# EAGLE design Frame2TTL_v2_1_1 (EAGLE 9.6.2)
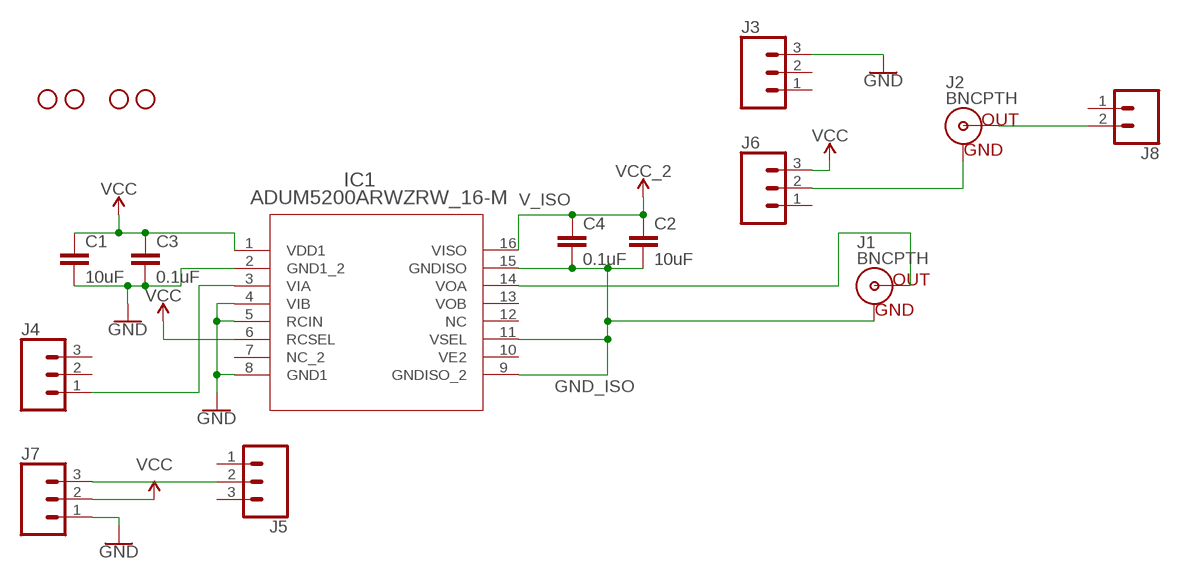
[diagram p0: schematic, sheet 1]

## Parts
C1  10uF  10UF-1206-6.3V-20%  [1206]
C2  10uF  10UF-1206-6.3V-20%  [1206]
C3  0.1uF  10UF-0805-10V-10%  [0805]
C4  0.1uF  10UF-0805-10V-10%  [0805]
H1  STAND-OFF  [STAND-OFF]
H2  STAND-OFF  [STAND-OFF]
H3  STAND-OFF  [STAND-OFF]
H4  STAND-OFF  [STAND-OFF]
IC1  ADUM5200ARWZRW_16-M  [RW_16-M]
J1  BNCPTH  [BNC]
J2  BNCPTH  [BNC]
J3  CONN_03LOCK  [1X03_LOCK]
J4  CONN_03LOCK  [1X03_LOCK]
J5  CONN_03LOCK  [1X03_LOCK]
J6  CONN_03LOCK  [1X03_LOCK]
J7  CONN_03LOCK  [1X03_LOCK]
J8  CONN_02  [1X02]

## Nets
AGND: J2.GND J6.2
GND: C1.2 C3.2 IC1.2(GND1_2) IC1.4(VIB) IC1.5(RCIN) IC1.8(GND1) J3.3 J7.1
GND_ISO: C2.2 C4.2 IC1.9(GNDISO_2) IC1.11(VSEL) IC1.15(GNDISO) J1.GND
N$1: J2.S(OUT) J8.2
N$2: IC1.3(VIA) J4.1
N$3: J5.2 J7.3
N$6: IC1.14(VOA) J1.S(OUT)
V_ISO: C2.1 C4.1 IC1.16(VISO) ; supply symbol labelled VCC_2
VCC: C1.1 C3.1 IC1.1(VDD1) IC1.6(RCSEL) J6.3 J7.2
Unconnected: IC1.7(NC_2) IC1.10(VE2) IC1.12(NC) IC1.13(VOB) J3.1 J3.2 J4.2 J4.3 J5.1 J5.3 J6.1 J8.1

## Library data of the parts
C1 C2 = SparkFun-Capacitors:10UF: 10.0µF ceramic capacitors A capacitor is a passive two-terminal electrical component used to store electrical energy temporarily in an electric field.; PROD_ID: CAP-10057
C3 C4 = SparkFun-Capacitors:10UF: 10.0µF ceramic capacitors A capacitor is a passive two-terminal electrical component used to store electrical energy temporarily in an electric field.; PROD_ID: CAP-11330; VALUE: 10uF
H1-H4 = SparkFun-Hardware:STAND-OFF: Stand Off Drill holes for mechanically mounting via screws, standoffs, etc. Note: Use the keepout ring to avoid running the screw head into surrounding components. Variant Overviews STAND-OFF - Mechanical footprint for a #4 phillips button head screw. STAND-OFF-TIGHT - Mechanical footprint for a #4 phillips button head screw, Example SparkFun Products Screw - Phillips Head (1/4", 4-40, 10 pack) <https://www.sparkfun.com/products/10453> (PRT-10453) Screw - Phillips Head (1/2", 4-40, 10 pack) <https://www.sparkfun.com/products/10452> (PRT-10452) Screw - Phillips Head (3/4", 4-40, 10 pack) <https://www.sparkfun.com/products/10451> (PRT-10451) Screw - Phillips Head (1", 4-40, 10 pack) <https://www.sparkfun.com/products/10450> (PRT-10450)
IC1 = ADUM5200:ADUM5200ARWZ
J1 J2 = SparkFun-Connectors:BNC: BNC Right Angle Connector Mouser Part# 5227161 SparkFun Products: BNC Connector - Right Angle <https://www.sparkfun.com/products/10550>; PROD_ID: LPA-12729; SF_ID: PRT-10550
J3-J7 = SparkFun-Connectors:CONN_03: Multi connection point. Often used as Generic Header-pin footprint for 0.1 inch spaced/style header connections On any of the 0.1 inch spaced packages, you can populate with these: Break Away Headers - Straight <https://www.sparkfun.com/products/116> (PRT-00116) Break Away Male Headers - Right Angle <https://www.sparkfun.com/products/553> (PRT-00553) Female Headers <https://www.sparkfun.com/products/115> (PRT-00115) Break Away Headers - Machine Pin <https://www.sparkfun.com/products/117> (PRT-00117) Break Away Female Headers - Swiss Machine Pin <https://www.sparkfun.com/products/743> (PRT-00743) Stackable Header - 3 Pin (Female, 0.1") <https://www.sparkfun.com/products/13875> (PRT-13875) For SCREWTERMINALS and SPRING TERMINALS visit here: Screw Terimnals on SparkFun.com <https://www.sparkfun.com/search/results?term=Screw+Terminals> (5mm/3.5mm/2.54mm spacing) This device is also useful as a general connection point to wire up your design to another part of your project. Our various solder wires solder well into these plated through hole pads. Hook-Up Wire - Assortment (Stranded, 22 AWG) <https://www.sparkfun.com/products/11375> (PRT-11375) Hook-Up Wire - Assortment (Solid Core, 22 AWG) <https://www.sparkfun.com/products/11367> (PRT-11367) View the entire wire category on our website here <https://www.sparkfun.com/categories/141> Special notes: Molex polarized connector foot print use with SKU : PRT-08232 with associated crimp pins and housings.
J8 = SparkFun-Connectors:CONN_02: Multi connection point. Often used as Generic Header-pin footprint for 0.1 inch spaced/style header connections On any of the 0.1 inch spaced packages, you can populate with these: Break Away Headers - Straight <https://www.sparkfun.com/products/116> (PRT-00116) Break Away Male Headers - Right Angle <https://www.sparkfun.com/products/553> (PRT-00553) Female Headers <https://www.sparkfun.com/products/115> (PRT-00115) Break Away Headers - Machine Pin <https://www.sparkfun.com/products/117> (PRT-00117) Break Away Female Headers - Swiss Machine Pin <https://www.sparkfun.com/products/743> (PRT-00743) For SCREWTERMINALS and SPRING TERMINALS visit here: Screw Terimnals on SparkFun.com <https://www.sparkfun.com/search/results?term=Screw+Terminals> (5mm/3.5mm/2.54mm spacing) This device is also useful as a general connection point to wire up your design to another part of your project. Our various solder wires solder well into these plated through hole pads. Hook-Up Wire - Assortment (Stranded, 22 AWG) <https://www.sparkfun.com/products/11375> (PRT-11375) Hook-Up Wire - Assortment (Solid Core, 22 AWG) <https://www.sparkfun.com/products/11367> (PRT-11367) View the entire wire category on our website here <https://www.sparkfun.com/categories/141> Special notes: Molex polarized connector foot print use with: PRT-08233 with associated crimp pins and housings. 2.54_SCREWTERM for use with PRT-10571. 3.5mm Screw Terminal footprints for PRT-08084 5mm Screw Terminal footprints for use with PRT-08432

## Board
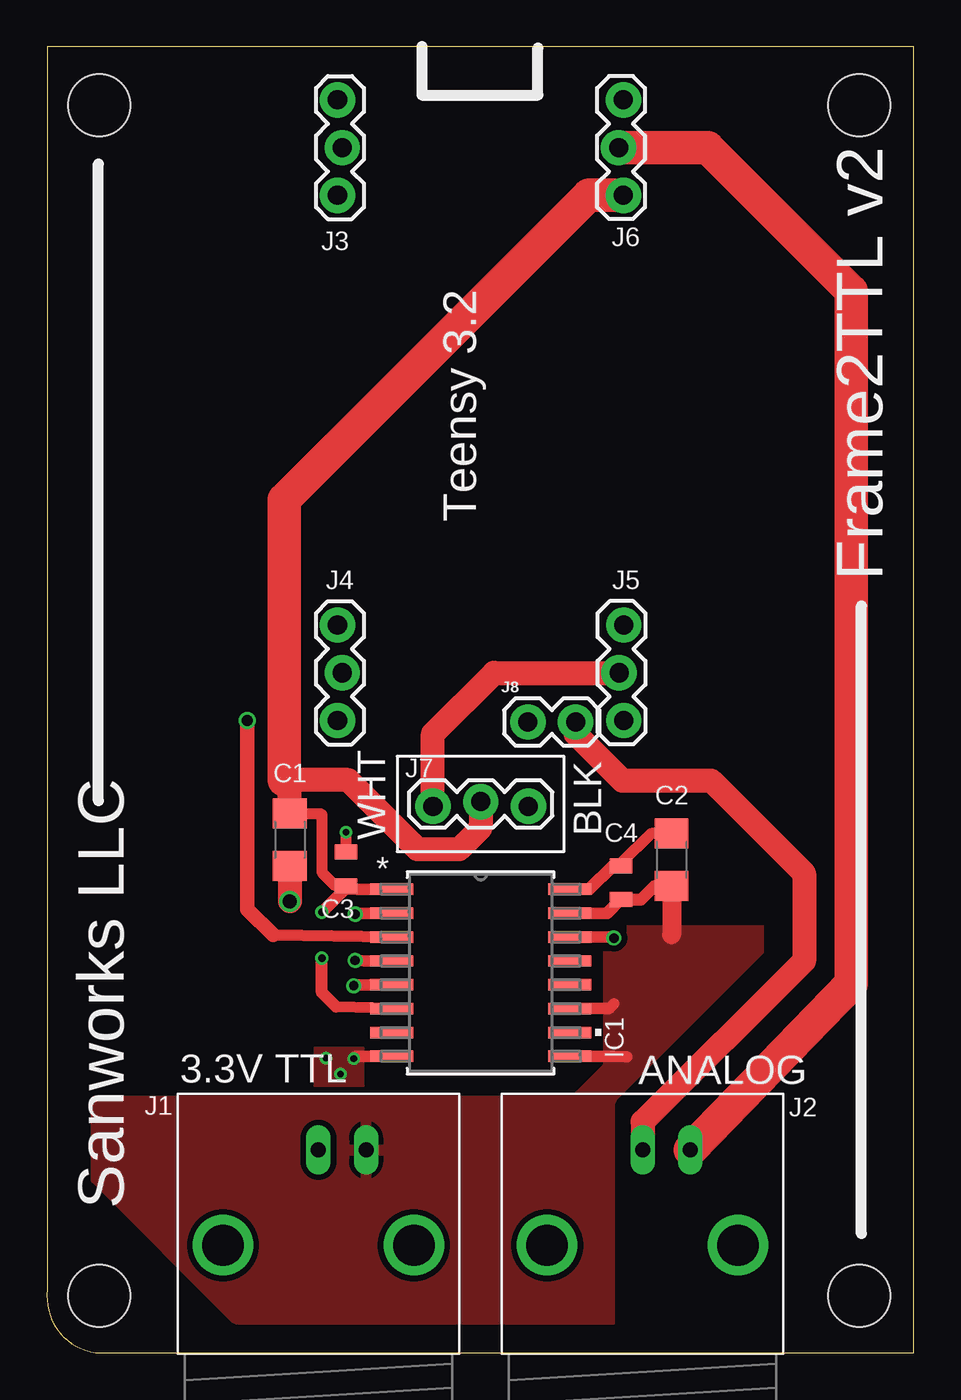
[diagram p1: board, top side]
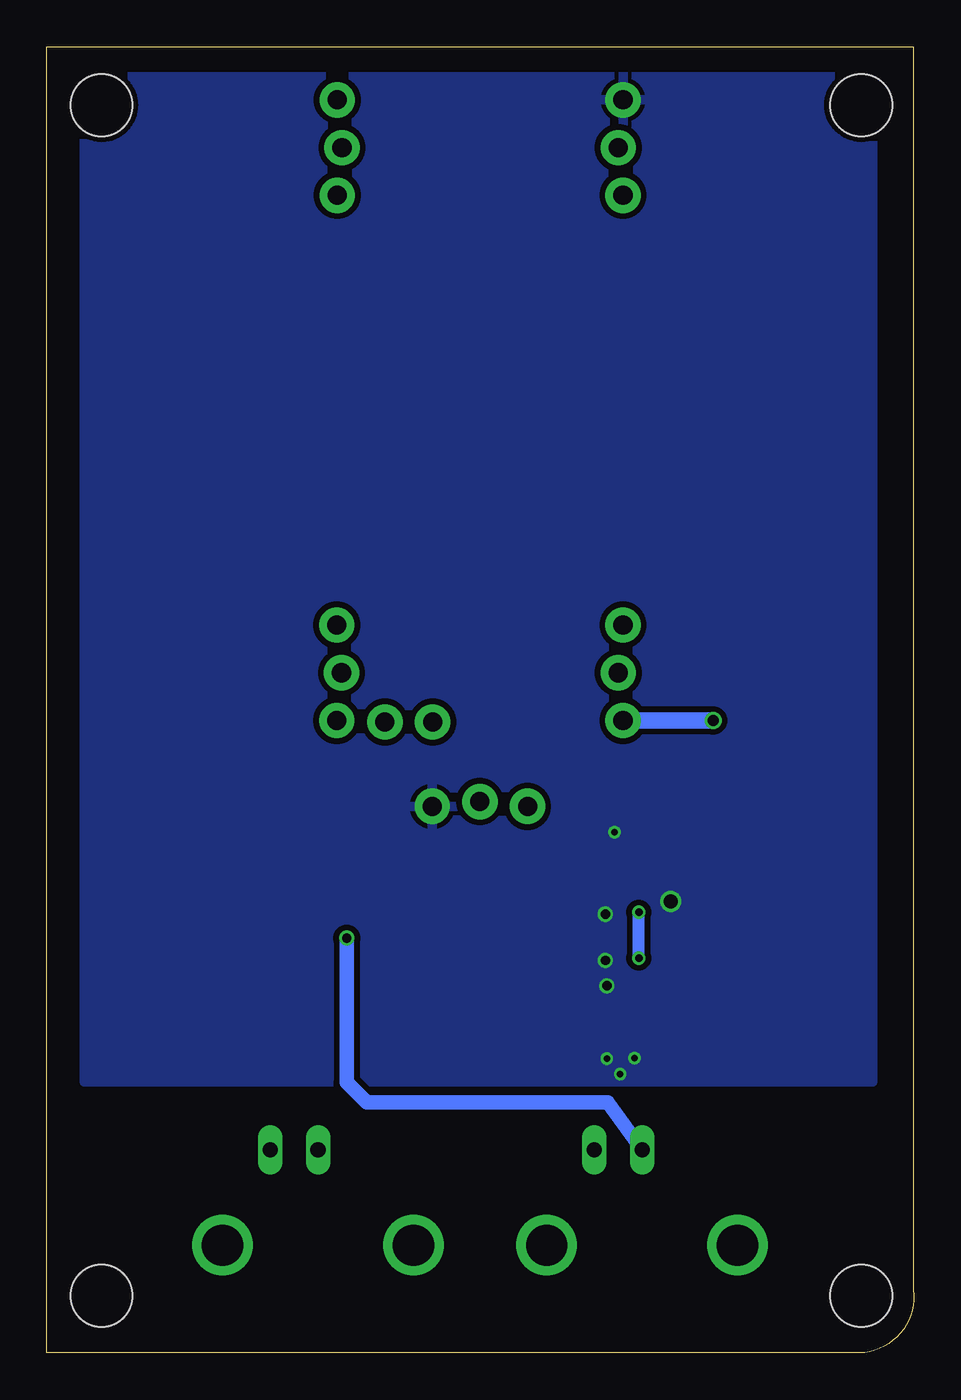
[diagram p2: board, bottom side, seen from below]

Size 46.13 x 69.52 mm. Coordinates in mm from the lower left corner, seen from the top.
Outline: 2.59,0 46.13,0 46.13,69.52 0.02,69.52 0.02,3.33 arc90 2.59,0
Copper layers (1*16): Top 0.035mm / dielectric 1.5mm / Bottom 0.035mm
Design rules "SeeedStudio_2layer_DRU_no_angle_20140221 *": minimum track width 12mil, minimum drill 12mil, track to track 12mil, track to pad 12mil, pad to pad 12mil, via to via 12mil, smd to smd 0mil, copper to edge 10mil, drill to drill 10mil, minimum pad ring 10mil, minimum via ring 6mil, stop-mask expansion 2mil, vias tented up to drill 100mil, thermal gap 10mil
tRestrict: area 30.6,0.6 to 45.7,22.6

### Footprints (pad centres in the part's own frame; a part is rotated, then mirrored left to right if it is on the bottom)
1206 = smd 1.6 x 1.8: 1 -1.4,0; 2 1.4,0
0805 = smd 0.8 x 1.2: 1 -0.9,0; 2 0.9,0
STAND-OFF = hole 3.302: 0,0
RW_16-M = smd 2.286 x 0.61: 1 -4.737,4.445; 2 -4.737,3.175; 3 -4.737,1.905; 4 -4.737,0.635; 5 -4.737,-0.635; 6 -4.737,-1.905; 7 -4.737,-3.175; 8 -4.737,-4.445; 9 4.737,-4.445; 10 4.737,-3.175; 11 4.737,-1.905; 12 4.737,-0.635; 13 4.737,0.635; 14 4.737,1.905; 15 4.737,3.175; 16 4.737,4.445
BNC = drill 2.2: 3 -5.08,5.08; 4 5.08,5.08 | drill 0.8 long: GND -2.54,0; S 0,0
1X03_LOCK = drill 1.016 pad 1.88: 1 0,0.127; 2 2.54,-0.127; 3 5.08,0.127
1X02 = drill 1.016 pad 1.88: 1 0,0; 2 2.54,0

### Placement (x,y rotation side)
C1  12.93,27.3 270 top
C2  33.25,26.24 270 top
C3  15.92,25.76 90 top
C4  30.55,25.02 270 top
H1  43.23,66.42 0 top
H2  2.79,66.42 0 top
H3  43.23,3.02 0 top
H4  2.79,3.02 0 top
IC1  23.09,20.22 0 top
J1  14.45,10.79 180 top
J2  31.7,10.79 180 top
J3  15.59,61.62 90 top
J4  15.59,33.66 90 top
J5  30.58,38.73 270 top
J6  30.55,66.7 270 top
J7  25.63,29.21 180 top
J8  25.6,33.58 0 top

### Tracks (layer width: path | path; a pad name or v marks a point on that pad's centre or on a via)
AGND
  Top 1.778: J6.2 35.18,64.16 42.82,56.51 42.82,19.63 J2.GND
GND  (via drill 0.35, 0.5, 0.75)
  Top 0.584: 16.46,15.77 v16.33,15.65 | C3.2 v15.92,27.71
  Top 0.61: IC1.8 16.46,15.77 | IC1.5 16.33,19.58 v16.33,19.53 | v16.41,20.88 16.89,20.85 IC1.4 | IC1.2 16.41,23.39 v16.41,23.34
  Top 1.27: C1.2 v12.93,24.03
  other vias: 14.86,15.67 15.62,14.83
  pour Bottom: 2.18,67.94 2.18,14.4 44.14,14.4 44.14,67.94
  pour Top: 16.84,14.22 16.84,16.21 14.25,16.21 14.25,14.22
GND_ISO
  Top 0.584: 29.92,18.31 30.17,18.57 | 33.25,22.25 33.22,22.22 | C4.2
  Top 0.61: IC1.11 29.92,18.31 | 30.86,15.75 30.13,15.77 IC1.9 | IC1.15 29.82,23.39
  Top 0.635: 29.82,23.39 C4.2 | C4.2 31.62,24.12 32.34,24.84 C2.2
  Top 1.016: C2.2 33.25,22.25
  pour Top: 29.87,22.45 29.87,15.21 28.04,13.39 2.59,13.39 2.59,9.27 10.06,1.8 44.19,1.8 44.19,22.45
N$1
  Top 1.27: J8.2 28.14,32.94 30.63,30.45 35.35,30.45 40.31,25.5 40.31,20.85 31.75,12.3 31.7,12.29 J2.S
N$2  (via drill 0.6)
  Top 0.61: IC1.3 12.04,22.22
  Top 0.762: 12.04,22.22 10.67,23.6 v10.67,33.65
  Bottom 0.889: v10.67,33.65 J4.1
N$3
  Top 1.27: J7.3 20.55,32.94 23.8,36.19 J5.2
N$6  (via drill 0.5)
  Top 0.61: IC1.14 30.12,22.12 v30.17,22.07
  Bottom 0.762: v30.17,22.07 30.17,14.38 29.11,13.31 16.29,13.31 J1.S
V_ISO
  Top 0.584: C2.1 32.16,27.64 30.55,26.03 C4.1 | IC1.16 28.88,24.66
  Top 0.635: 28.88,24.66 30.13,25.92 C4.1
VCC  (via drill 0.4)
  Top 0.584: C1.1 14.55,28.7 14.63,28.63 14.63,25.58 15.35,24.86 C3.1 | 16.02,24.69 15.92,24.78 C3.1 | IC1.6 15.39,18.41 | 15.92,24.74 C3.1
  Top 0.61: 16.02,24.69 16.54,24.66 IC1.1
  Top 0.635: 15.39,18.41 14.63,19.18 v14.63,21.01 | v14.63,23.44 15.92,24.74
  Top 1.27: C1.1 12.93,30.48 | J7.2 23.09,27.94 21.94,26.8 19.73,26.8 16.05,30.48 12.93,30.48 | 12.93,30.48 12.62,30.48
  Top 1.778: J6.3 28.83,61.62 12.62,45.41 12.62,30.48
  Bottom 0.635: v14.63,21.01 v14.63,23.44

### Text on the board
tPlace: Teensy 3.2 | Frame2TTL v2 | WHT | BLK | 3.3V TTL | ANALOG | Sanworks LLC